# Altium schematic sheet Schematic.SchDoc
size 431 x 279 mm; Organization: ORGANIZATION; Address1: ADDRESS 1; Address2: ADDRESS 2; Address3: ADDRESS 3; Address4: ADDRESS 4; Revision: -; SheetNumber: 1; SheetTotal: 1; ENG_APP_DATE: --/--/--; DSN_APP_DATE: --/--/--; CHK_APP_DATE: --/--/--
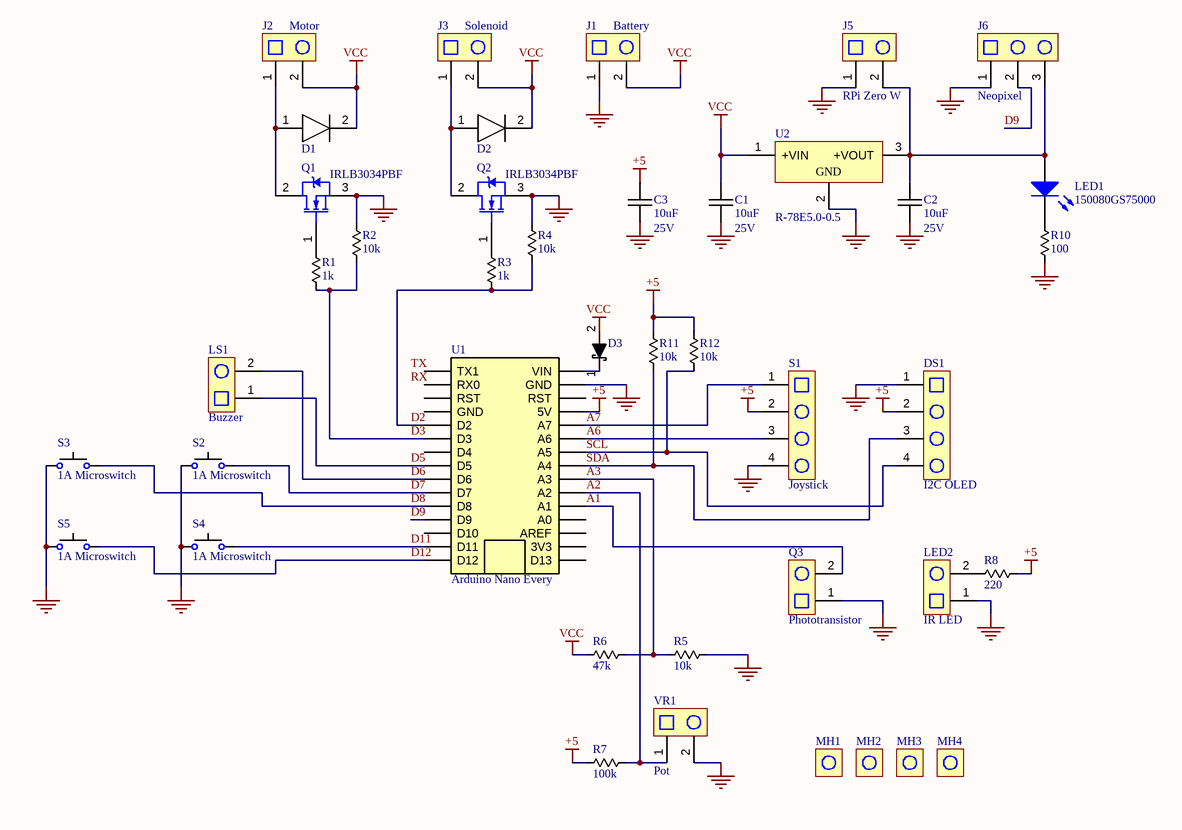
[diagram p0: Schematic.SchDoc]

## Parts
C1  10uF  Voltage Rating: 25V  [chip_0805]
C2  10uF  Voltage Rating: 25V  [chip_0805]
C3  10uF  Voltage Rating: 25V  [chip_0805]
D1  Diode Thru-Hole 0.5"  [D-1]  (value not drawn)
D2  Diode Thru-Hole 0.5"  [D-1]  (value not drawn)
D3  MBRA340T3G  [do-214ac]  (value not drawn)
DS1  I2C OLED  [J-5]
J1  Battery  [J-6-LONG]
J2  Motor  [J-6]
J3  Solenoid  [J-6]
J5  RPi Zero W  [J-3]
J6  Neopixel  [J-4]
LED1  150080GS75000  [0805_A]
LED2  IR LED  [J-3]
LS1  Buzzer  [J-3]
MH1  MH-1  [MH-1]  (value not drawn)
MH2  MH-1  [MH-1]  (value not drawn)
MH3  MH-1  [MH-1]  (value not drawn)
MH4  MH-1  [MH-1]  (value not drawn)
Q1  IRLB3034PBF  [INF-PG-TO-220AB]
Q2  IRLB3034PBF  [INF-PG-TO-220AB]
Q3  Phototransistor  [J-3]
R1  1k  [chip_0805]
R2  10k  [chip_0805]
R3  1k  [chip_0805]
R4  10k  [chip_0805]
R5  10k  [chip_0805]
R6  47k  [chip_0805]
R7  100k  [axial_0.3]
R8  220  [chip_0805]
R10  100  [chip_0805]
R11  10k  [chip_0805]
R12  10k  [chip_0805]
S1  Joystick  [J-5]
S2  1A Microswitch  [J-3]
S3  1A Microswitch  [J-3]
S4  1A Microswitch  [J-3]
S5  1A Microswitch  [J-3]
U1  Arduino Nano Every  [ARDUINO_NANO]
U2  R-78E5.0-0.5  [REPO-R-78E-0.5-3_V]
VR1  Pot  [J-3]

## Nets
+5: C3.1 DS1.2 R7.1 R8.1 R11.2 R12.2 S1.2 U1.27(5V)
GND: C1.2 C2.2 C3.2 DS1.1 J1.1 J5.1 J6.1 LED2.1 Q1.3(S) Q2.3(S) Q3.1 R2.1 R4.1 R5.2 R10.2 S1.4 S2.1 S3.1 S4.1 S5.1 U1.29(GND) U2.2(GND) VR1.2
VCC: C1.1 D1.2(-) D2.2(-) D3.2 J1.2 J2.2 J3.2 R6.1 U2.1(+VIN)
A1: Q3.2 U1.20(A1)
A2: R7.2 U1.21(A2) VR1.1
A3: R5.1 R6.2 U1.22(A3)
A6: S1.3 U1.25(A6)
A7: S1.1 U1.26(A7)
D2: R3.2 R4.2 U1.5(D2)
D3: R1.2 R2.2 U1.6(D3)
D5: LS1.1 U1.8(D5)
D6: LS1.2 U1.9(D6)
D7: S2.2 U1.10(D7)
D8: S3.2 U1.11(D8)
D9: J6.2 U1.12(D9)
D11: S4.2 U1.14(D11)
D12: S5.2 U1.15(D12)
SCL: DS1.4 R12.1 U1.24(A5)
SDA: DS1.3 R11.1 U1.23(A4)
NetC2_1: C2.1 J5.2 J6.3 LED1.2(A) U2.3(+VOUT)
NetD1_1: D1.1(+) J2.1 Q1.2(D)
NetD2_1: D2.1(+) J3.1 Q2.2(D)
NetD3_1: D3.1 U1.30(VIN)
NetLED1_1: LED1.1(K) R10.1
NetLED2_2: LED2.2 R8.2
NetQ1_1: Q1.1(G) R1.1
NetQ2_1: Q2.1(G) R3.1

Not connected (* = marked no-connect by the designer): U1 1(TX1) 2(RX0) 3(RST) 4(GND) 7(D4) 13(D10) 16(D13) 17(3V3) 18(AREF) 19(A0) 28(RST)

## Notes on the sheet
- Labels drawn without touching a wire or pin: RX, TX
- DWG. NO.
- REV.
- SHT.
- THIS DOCUMENT AND THE DATA DISCLOSED HEREIN OR HEREWITH IS THE PROPERTY OF ALTIUM LIMITED AND MAY BE FREELY DISTRIBUTED IN WHOLE. NO RIGHTS ARE RESERVED OR EXPRESS OR IMPLIED WARANTEE GIVEN.
- REVISION
- DESCRIPTION
- DATE
- APPROVED
- ENG:
- APPROVALS
- PROJECT
- DSN:
- CHK:
- REFERENCE DOCUMENTS
- PROJECT REVISION:
- TITLE
- DOCUMENT REVISION:
- DESIGN ITEM:
- BOM:
- FAB DWG:
- PCB DWG:
- ASSY DWG:
- SCALE:
- SIZE
- B
- CAGE CODE
- FILE NAME
- DWG NO.
- SHEET
- OF
- REV

## Library data of the parts
C1-C3 = CAP-00131: CAP, 10uF, 10%, 25V, X7R, 0805; Manufacturer: Murata; Manufacturer PN: GRM21BR71A106KA73L; Part Number: CAP-00131; Capacitance: 10uF; Tolerance: 10%; Type: X7R
D1 D2 = D-1: Supplier 1: Mouser; Supplier Part Number 1: 625-5KP60A-E3
D3 = DIO-00005: Dio Shtky, 3A, 0.45V, 40V, SMA; Manufacturer: ON Semi; Forward Voltage: 450mV; Type: Schottky; Part Number: DIO-00005; Reverse Breakdown Voltage: 40V; Current Rating: 3A; Manufacturer PN: MBRA340T3G; Supplier 1: Arrow Electronics; Supplier Part Number 1: CDBA340-G
DS1 S1 = J-5: 4 pin Thru-Hole AWG 24
J1 = J-6-LONG: 2 pin Thru-Hole AWG 16 Larger Spacing
J2 J3 = J-6: 2 pin Thru-Hole AWG 16
J5 LED2 LS1 Q3 VR1 = J-3: 2 pin Thru-Hole AWG 24
J6 = J-4: 3 pin Thru-Hole AWG 24
LED1 = CMP-1426-00007-1: SMD mono-color Chip LED, WL-SMCW, Green; Manufacturer: Wuerth Elektronik; PackageReference: 0805_A; Color: Green; PartNumber: 150080GS75000; ComponentLink2URL: http://katalog.we-online.com/led/datasheet/150080GS75000.pdf; ComponentLink1URL: http://www.we-online.com; ComponentLink1Description: Manufacturer URL; ComponentLink2Description: Datasheet
MH1-MH4 = MH-1: Mouting Hole M2.5
Q1 Q2 = CMP-2000-04998-1: Mosfet N-Channel, 40 V, 195 A, -55 to 175 degC, 3-Pin TO-220AB, RoHS, Tube; Manufacturer: International Rectifier; Typical TurnOff Delay Time: 97ns; Configuration: Single; Maximum Continuous Drain Current: 343A; Typical Input Capacitance @ Vds: 10315pF@25V; Maximum Power Dissipation: 375W; Maximum Gate Source Voltage: ±20V; Forward Diode Voltage: 1.3V; Maximum Drain Source Voltage: 40V; Typical Turn On Delay Time: 65ns; Maximum Drain Source Resistance: 2mΩ; Package Version: Feb-04; Channel Type: N; Channel Mode: Enhancement; Typical Gate Charge @ Vgs: 54nC@4.5V; Number of Elements per Chip: 1; Forward Transconductance: 286S; Datasheet URL: https://datasheet.ciiva.com/26325/161162-da-01-en-mosfet-irlb3034pbf-to220ab-ir-26325354.pdf; Series: HEXFETSeries; Datasheet Version: Jan-09; Pin Count: 3; Manufacturer URL: http://internationalrectifier.com/; Maximum Operating Temperature: +175degC; Operating Temperature Range: -55to+175degC; Height: 15.24mm; Mounting Type: ThroughHole; Dimensions: 10.54x4.69x15.24mm; Package Reference: PG-TO-220AB; Package Description: 3-Pin Plastic (Green) Transistor Single Outline Package, 9.9 x 9.2 mm Body, 2.54 mm Pitch; Category: PowerMOSFET; Length: 10.54mm; Package URL: http://www.infineon.com/dgdl/bts110.pdf?folderId=db3a304412b407950112b43583c16310&fileId=db3a304412b407950112b43584326311&sId=db3a30443e3c704d013e4eb6657a2604; Package Type: TO-220AB; Width: 4.69mm; Minimum Operating Temperature: -55degC
R1 R3 = RES-00361: RES SMD 1K OHM 1% 1/8W 0805; Manufacturer: Rohm Semiconductor; Manufacturer PN: KTR10EZPF1001; Power Rating: 0.125W; Part Number: RES-00361; Resistance: 1k; Tolerance: 1%
R2 R4 R5 R11 R12 = RES-00307: RES SMD 10K OHM 1% 1/8W 0805; Manufacturer: Rohm Semiconductor; Manufacturer PN: KTR10EZPF1002; Power Rating: 0.125W; Part Number: RES-00307; Resistance: 10k; Tolerance: 1%
R6 = RES-00493: RES SMD 47K OHM 1% 1/8W 0805; Manufacturer: Rohm Semiconductor; Manufacturer PN: KTR10EZPF4702; Power Rating: 0.125W; Part Number: RES-00493; Resistance: 47k; Tolerance: 1%
R7 = RES-00609: RES THT 100K OHM 1% 1/4W 0.3" AXIAL; Power Rating: 0.25W; Part Number: RES-00609; Resistance: 100k; Tolerance: 1%
R8 = RES-00202: RES SMD 220 OHM 1% 1/8W 0805; Manufacturer: Rohm Semiconductor; Manufacturer PN: KTR10EZPF2200; Power Rating: 0.125W; Part Number: RES-00202; Resistance: 220; Tolerance: 1%
R10 = RES-00179: RES SMD 100 OHM 1% 1/8W 0805; Manufacturer: Rohm Semiconductor; Manufacturer PN: KTR10EZPF1000; Power Rating: 0.125W; Part Number: RES-00179; Resistance: 100; Tolerance: 1%
S2-S5 = S-1
U1 = U-1: Arduino Nano Every, SMD Footprint
U2 = CMP-2000-06922-2: DC/DC-Converter, 5 V Single Output, 500 mA, -40 to 85 degC, 3-Pin THD, RoHS, Tube; Manufacturer: Recom Power; Efficiency: 92%; Number of Outputs: 1; Current - Output (Max): 500mA; VIN Min: 7V; Package Version: Rev. 0; VIN Max: 28V; VOUT: 5V; Manufacturer URL: http://www.recom-power.com/us/americas/home.html; Operating Temperature: -40°C~85°C; Datasheet Version: 01/2017; Packaging: Tube; Package Reference: SIP Module; Datasheet URL: http://www.recom-power.com/pdf/Innoline/R-78Exx-0.5.pdf; Package Description: 3-Pin Through Hole Device, Body 11.6 x 8.5 mm, Pitch 2.54 mm; Mounting Technology: ThroughHole